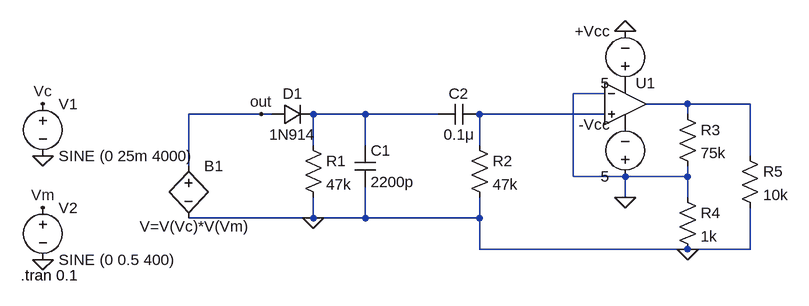
[diagram p0: schematic ερώτημα 12.asc]
ερώτημα 12.asc, the LTspice schematic file:
Version 4
SHEET 1 1044 680
WIRE 752 16 704 16
WIRE 880 32 816 32
WIRE 976 32 880 32
WIRE 224 48 112 48
WIRE 240 48 224 48
WIRE 384 48 304 48
WIRE 496 48 384 48
WIRE 752 48 560 48
WIRE 880 48 880 32
WIRE 304 96 304 48
WIRE 384 96 384 48
WIRE 560 96 560 48
WIRE 976 112 976 32
WIRE 112 128 112 48
WIRE 704 144 704 16
WIRE 784 144 704 144
WIRE 880 144 880 128
WIRE 880 144 784 144
WIRE 784 176 784 144
WIRE 880 176 880 144
WIRE 304 208 304 176
WIRE 304 208 112 208
WIRE 384 208 384 160
WIRE 384 208 304 208
WIRE 560 208 560 176
WIRE 560 208 384 208
WIRE 560 256 560 208
WIRE 880 256 560 256
WIRE 976 256 976 192
WIRE 976 256 880 256
FLAG -112 112 0
FLAG -112 272 0
FLAG -112 32 Vc
FLAG -112 192 Vm
FLAG 304 208 0
FLAG 224 48 out
FLAG 784 176 0
FLAG 880 256 0
FLAG 784 -80 0
SYMBOL voltage -112 16 R0
SYMATTR InstName V1
SYMATTR Value SINE (0 25m 4000)
SYMBOL voltage -112 176 R0
SYMATTR InstName V2
SYMATTR Value SINE (0 0.5 400)
SYMBOL bv 112 112 R0
WINDOW 3 -75 109 Left 2
SYMATTR InstName B1
SYMATTR Value V=V(Vc)*V(Vm)
SYMBOL res 288 80 R0
SYMATTR InstName R1
SYMATTR Value 47k
SYMBOL diode 240 64 R270
WINDOW 0 32 32 VTop 2
WINDOW 3 0 32 VBottom 2
SYMATTR InstName D1
SYMATTR Value 1N914
SYMBOL cap 368 96 R0
SYMATTR InstName C1
SYMATTR Value 2200p
SYMBOL OpAmps\\UniversalOpamp2 784 32 R0
SYMATTR InstName U1
SYMBOL voltage 784 16 R180
WINDOW 0 24 96 Left 2
WINDOW 3 24 16 Left 2
SYMATTR InstName +Vcc
SYMATTR Value 5
SYMBOL voltage 784 160 R180
WINDOW 0 24 96 Left 2
WINDOW 3 24 16 Left 2
SYMATTR InstName -Vcc
SYMATTR Value 5
SYMBOL cap 560 32 R90
WINDOW 0 0 32 VBottom 2
WINDOW 3 32 32 VTop 2
SYMATTR InstName C2
SYMATTR Value 0.1μ
SYMBOL res 544 80 R0
SYMATTR InstName R2
SYMATTR Value 47k
SYMBOL res 864 32 R0
SYMATTR InstName R3
SYMATTR Value 75k
SYMBOL res 864 160 R0
SYMATTR InstName R4
SYMATTR Value 1k
SYMBOL res 960 96 R0
SYMATTR InstName R5
SYMATTR Value 10k
TEXT -146 296 Left 2 !.tran 0.1

The netlist it stands for:
* ερώτημα 12.asc
V1 Vc 0 SINE (0 25m 4000)
V2 Vm 0 SINE (0 0.5 400)
B1 out 0 V=V(Vc)*V(Vm)
R1 N002 0 47k
D1 out N002 1N914
C1 N002 0 2200p
XU1 N003 0 P001 P002 N001 level.2 Avol=1Meg GBW=10Meg Slew=10Meg ilimit=25m rail=0 Vos=0 phimargin=45 en=0 enk=0 in=0 ink=0 Rin=500Meg  ; pins IN+ IN- V+ V- OUT
V§+Vcc P001 0 5
V§-Vcc 0 P002 5
C2 N003 N002 0.1μ
R2 N003 0 47k
R3 N001 0 75k
R4 0 0 1k
R5 N001 0 10k
.model D D
.lib standard.dio
.tran 0.1
.lib UniversalOpamps2.sub
.backanno
.end